# EAGLE schematic EEZ DIB AUX PS r3B6 (EAGLE 7.2.0)
Assembly variants: Farnell, TME

## Sheet 1 of 2: Power board tester
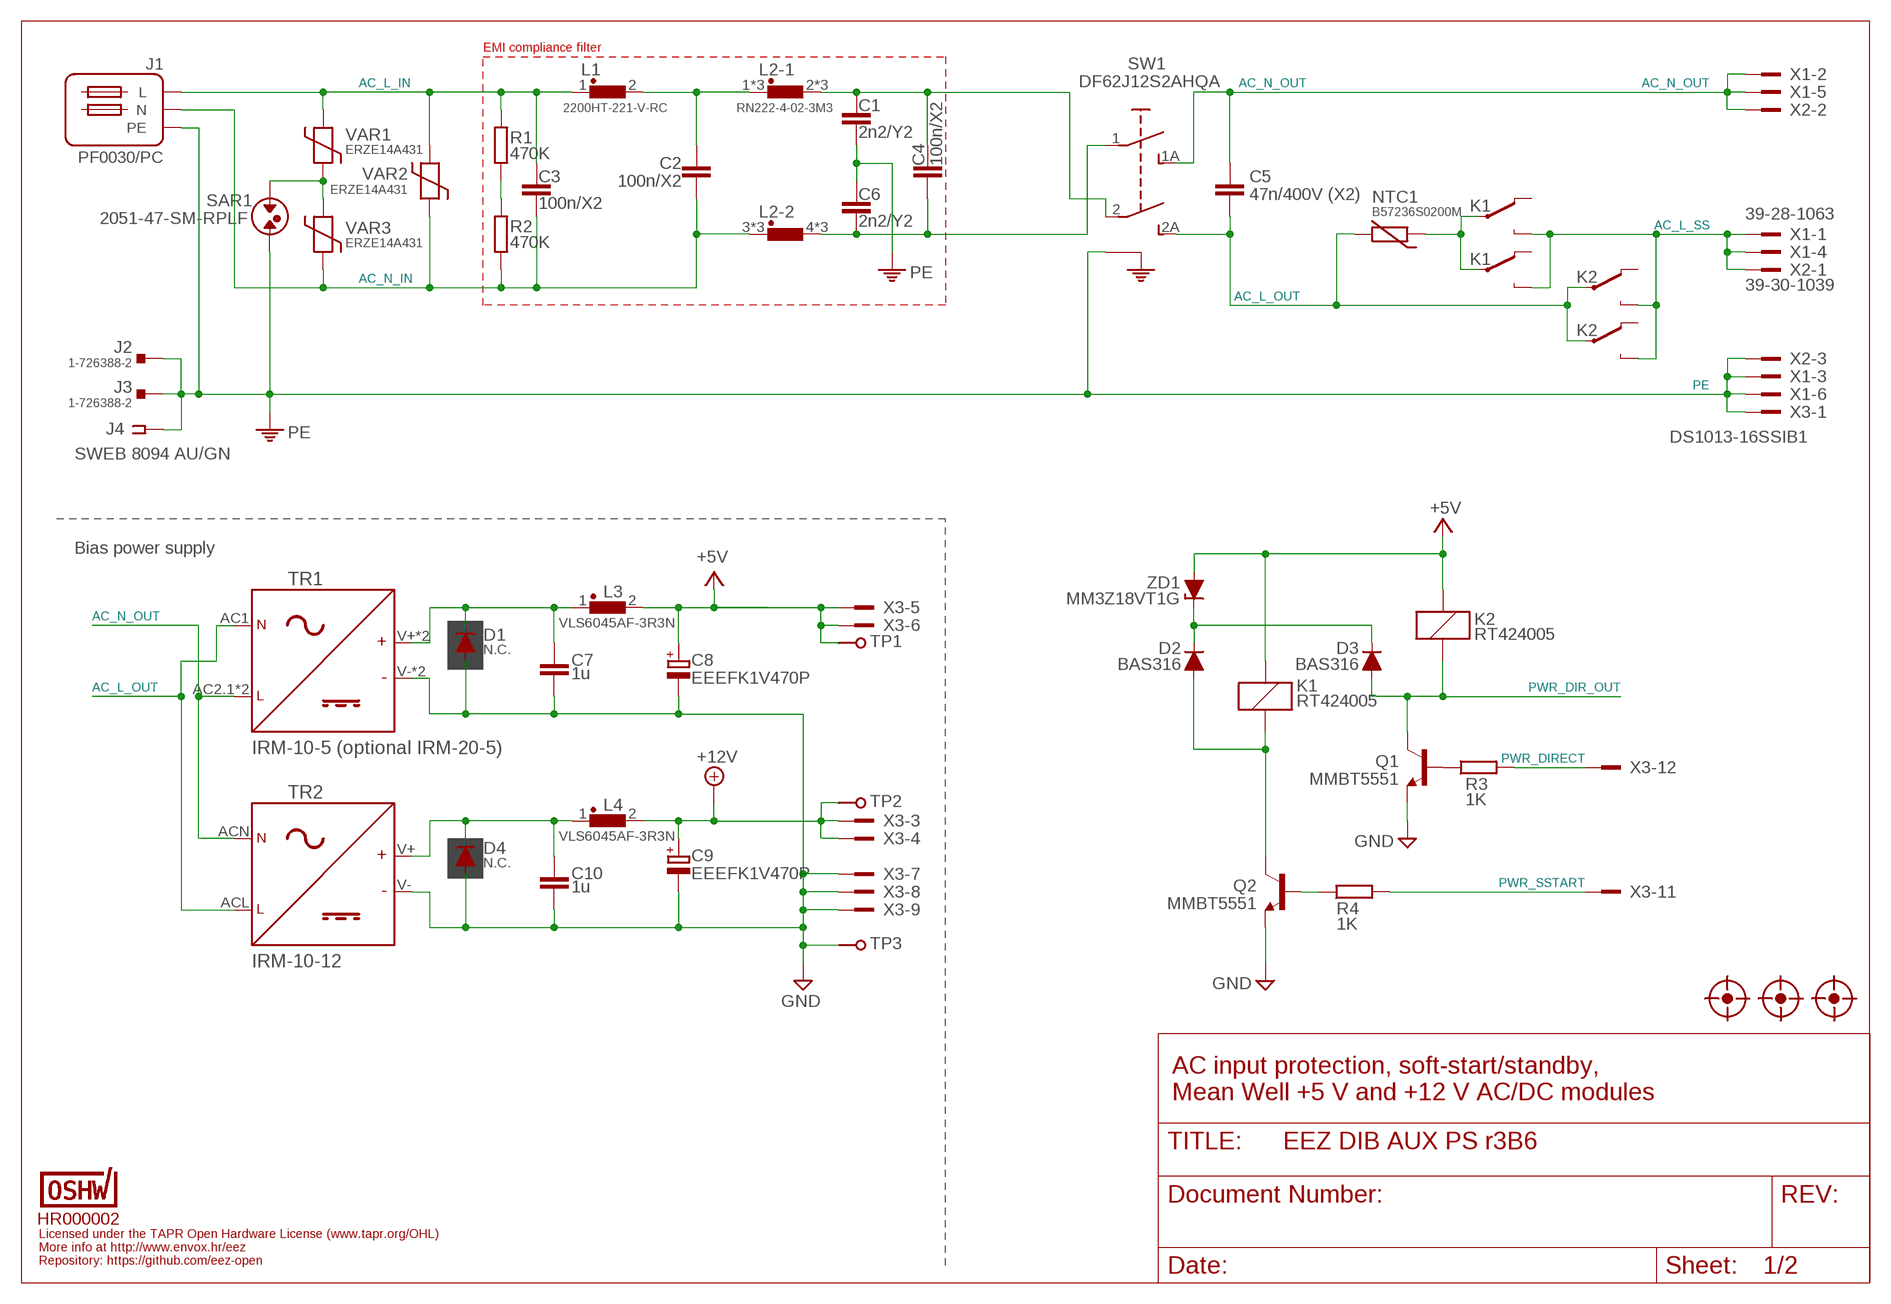
[diagram p0: schematic, sheet 1]

### Parts
C1  2n2/Y2  C-EU075-042X103  [C075-042X103]
C2  100n/X2  C-EU150-054X183  [C150-054X183]
C3  100n/X2  C-EU150-054X183  [C150-054X183]
C4  100n/X2  C-EU150-054X183  [C150-054X183]
C5  47n/400V (X2)  C-EU102-054X133  [C102-054X133]
C6  2n2/Y2  C-EU075-042X103  [C075-042X103]
C7  1u  C-EUC0805  [C0805]
C8  EEEFK1V470P  ECAPPANASONIC_H  [CAPAE660X610N]
C9  EEEFK1V470P  ECAPPANASONIC_H  [CAPAE660X610N]
C10  1u  C-EUC0805  [C0805]
D1  N.C.  DIODEDO214AA  [DO214AA]
D2  BAS316  DIODESOD323R  [SOD323-R]
D3  BAS316  DIODESOD323R  [SOD323-R]
D4  N.C.  DIODEDO214AA  [DO214AA]
FM1  FIDUCIAL  [FIDUCIAL]
FM2  FIDUCIAL  [FIDUCIAL]
FM3  FIDUCIAL  [FIDUCIAL]
J1  PF0030/PC  [PF0030/PC]
J2  1-726388-2  PCB_TAB4.8MM  [PCB_TAB-4.8MM]
J3  1-726388-2  PCB_TAB4.8MM  [PCB_TAB-4.8MM]
J4  SWEB 8094 AU/GN  BINDING_POSTCLIFF  [S16N-PC]
K1  RT424005  RELAY_RT314012-2  [RT-C/016A5_ROUND]
K2  RT424005  RELAY_RT314012-2  [RT-C/016A5_ROUND]
L1  2200HT-221-V-RC  BOURNS_2200  [BOURNS_2200]
L2  RN222-4-02-3M3  BOURNS_7100-COMBO  [BOURNS_7100_COMBO]
L3  VLS6045AF-3R3N  COILCRAFT_HPI0630  [COILCRAFT_HPI0630]
L4  VLS6045AF-3R3N  COILCRAFT_HPI0630  [COILCRAFT_HPI0630]
LABEL1  HR000002  OSHWA-CERT-SMALL  [CERT-SMALL-SILK]
NTC1  B57236S0200M  NTC11.5X6  [NTC_11.5X6_RM5]
Q1  MMBT5551  MMBT5551LT1-NPN-SOT23-BEC  [SOT23-BEC]
Q2  MMBT5551  MMBT5551LT1-NPN-SOT23-BEC  [SOT23-BEC]
R1  470K  R-EU_R1206  [R1206]
R2  470K  R-EU_R1206  [R1206]
R3  1K  R-EU_R0805  [R0805]
R4  1K  R-EU_R0805  [R0805]
SAR1  2051-47-SM-RPLF  SAR-SG  [SAR_4.5MM]
SW1  DF62J12S2AHQA  [DF62J12S2]
TP1  PCB_TEST_TABSHIELD  [PCB_SHIELD_TAB]
TP2  PCB_TEST_TABSHIELD  [PCB_SHIELD_TAB]
TP3  PCB_TEST_TABSHIELD  [PCB_SHIELD_TAB]
TR1  IRM-10-5 (optional IRM-20-5)  AC_DC_ADAPTERIRM10/20  [IRM-10/20_COMBO]
TR2  IRM-10-12  AC_DC_ADAPTERIRM10  [IRM-10]
VAR1  ERZE14A431  VARISTOR-16  [VARISTOR_16MM]
VAR2  ERZE14A431  VARISTOR-16  [VARISTOR_16MM]
VAR3  ERZE14A431  VARISTOR-16  [VARISTOR_16MM]
X1  39-28-1063  MINIFIT_5566-06A-CRE  [MINIFIT_5566-06A_CRE]
X2  39-30-1039  MINIFIT_39301039-CREEPAGE  [MINIFIT_39301039_CRE]
X3  DS1013-16SSIB1  IDC-16PIN  [IDC-16PIN]
ZD1  MM3Z18VT1G  ZENER-DIODESOD323R  [SOD323-R]

### Nets
+5V: C8.1(+) K1.A2(K:C1) K2.A1(K:C2) L3.2 TP1.1 X3.5 X3.6 ZD1.A ; also sheet 2
+12V: C9.1(+) L4.2 TP2.1 X3.3 X3.4 ; also sheet 2
AC_L_IN: C3.1 J1.L L1.1 R1.2 VAR1.2 VAR2.1
AC_L_OUT: C5.2 K2.11A(-1:P) K2.11B(-2:P) NTC1.1 SW1.2A(S1) TR1.AC1(AC/N) TR2.ACL(AC/L) ; also sheet 2
AC_L_RTC: C1.1 C4.2 L2.2 L2.2A L2.2B SW1.2(P1)
AC_L_SS: K1.14A(-1:O) K1.14B(-2:O) K2.14A(-1:O) K2.14B(-2:O) X1.1 X1.4 X2.1
AC_N_IN: C2.2 C3.2 J1.N L2.3 L2.3A L2.3B R2.1 VAR2.2 VAR3.1
AC_N_OUT: C5.1 SW1.1A(S) TR1.AC2.1(AC/L) TR1.AC2.2(AC/L) TR2.ACN(AC/N) X1.2 X1.5 X2.2 ; also sheet 2
AC_N_RTC: C4.1 C6.2 L2.4 L2.4A L2.4B SW1.1(P)
GND [gnd]: C7.2 C8.2(-) C9.2(-) C10.2 D1.A D4.A Q1.E Q2.E TP3.1 TR1.V-1(-) TR1.V-(-) TR2.V-(-) X3.7 X3.8 X3.9 ; also sheet 2
N$1: R1.1 R2.2
N$5: C2.1 L1.2 L2.1 L2.1A L2.1B
N$6: SAR1.1 VAR1.1 VAR3.2
N$7: K1.11A(-1:P) K1.11B(-2:P) NTC1.2
N$8: C10.1 D4.C L4.1 TR2.V+(+)
N$11: D2.C D3.C ZD1.C
N$12: Q2.B R4.1
N$15: C7.1 D1.C L3.1 TR1.V+1(+) TR1.V+(+)
N$16: D2.A K1.A1(K:C2) Q2.C
N$17: Q1.B R3.1
PE: C1.2 C6.1 J1.PE J2.1 J2.2 J3.1 J3.2 J4.1 J4.NC1 J4.NC2 J4.NC3 J4.NC4 SAR1.2 SW1.PE1(PE) SW1.PE2(PE) X1.3 X1.6 X2.3 X3.1
PWR_DIR_OUT: D3.A K2.A2(K:C1) Q1.C ; also sheet 2
PWR_DIRECT: R3.2 X3.12
PWR_SSTART: R4.2 X3.11
Unconnected: K1.12A(-1:S) K1.12B(-2:S) K2.12A(-1:S) K2.12B(-2:S) X3.10

### Notes on the sheet
- EMI compliance filter
- Bias power supply
- AC input protection, soft-start/standby,
  Mean Well +5 V and +12 V AC/DC modules
- Licensed under the TAPR Open Hardware License (www.tapr.org/OHL)
- More info at http://www.envox.hr/eez
- Repository: https://github.com/eez-open

## Sheet 2 of 2
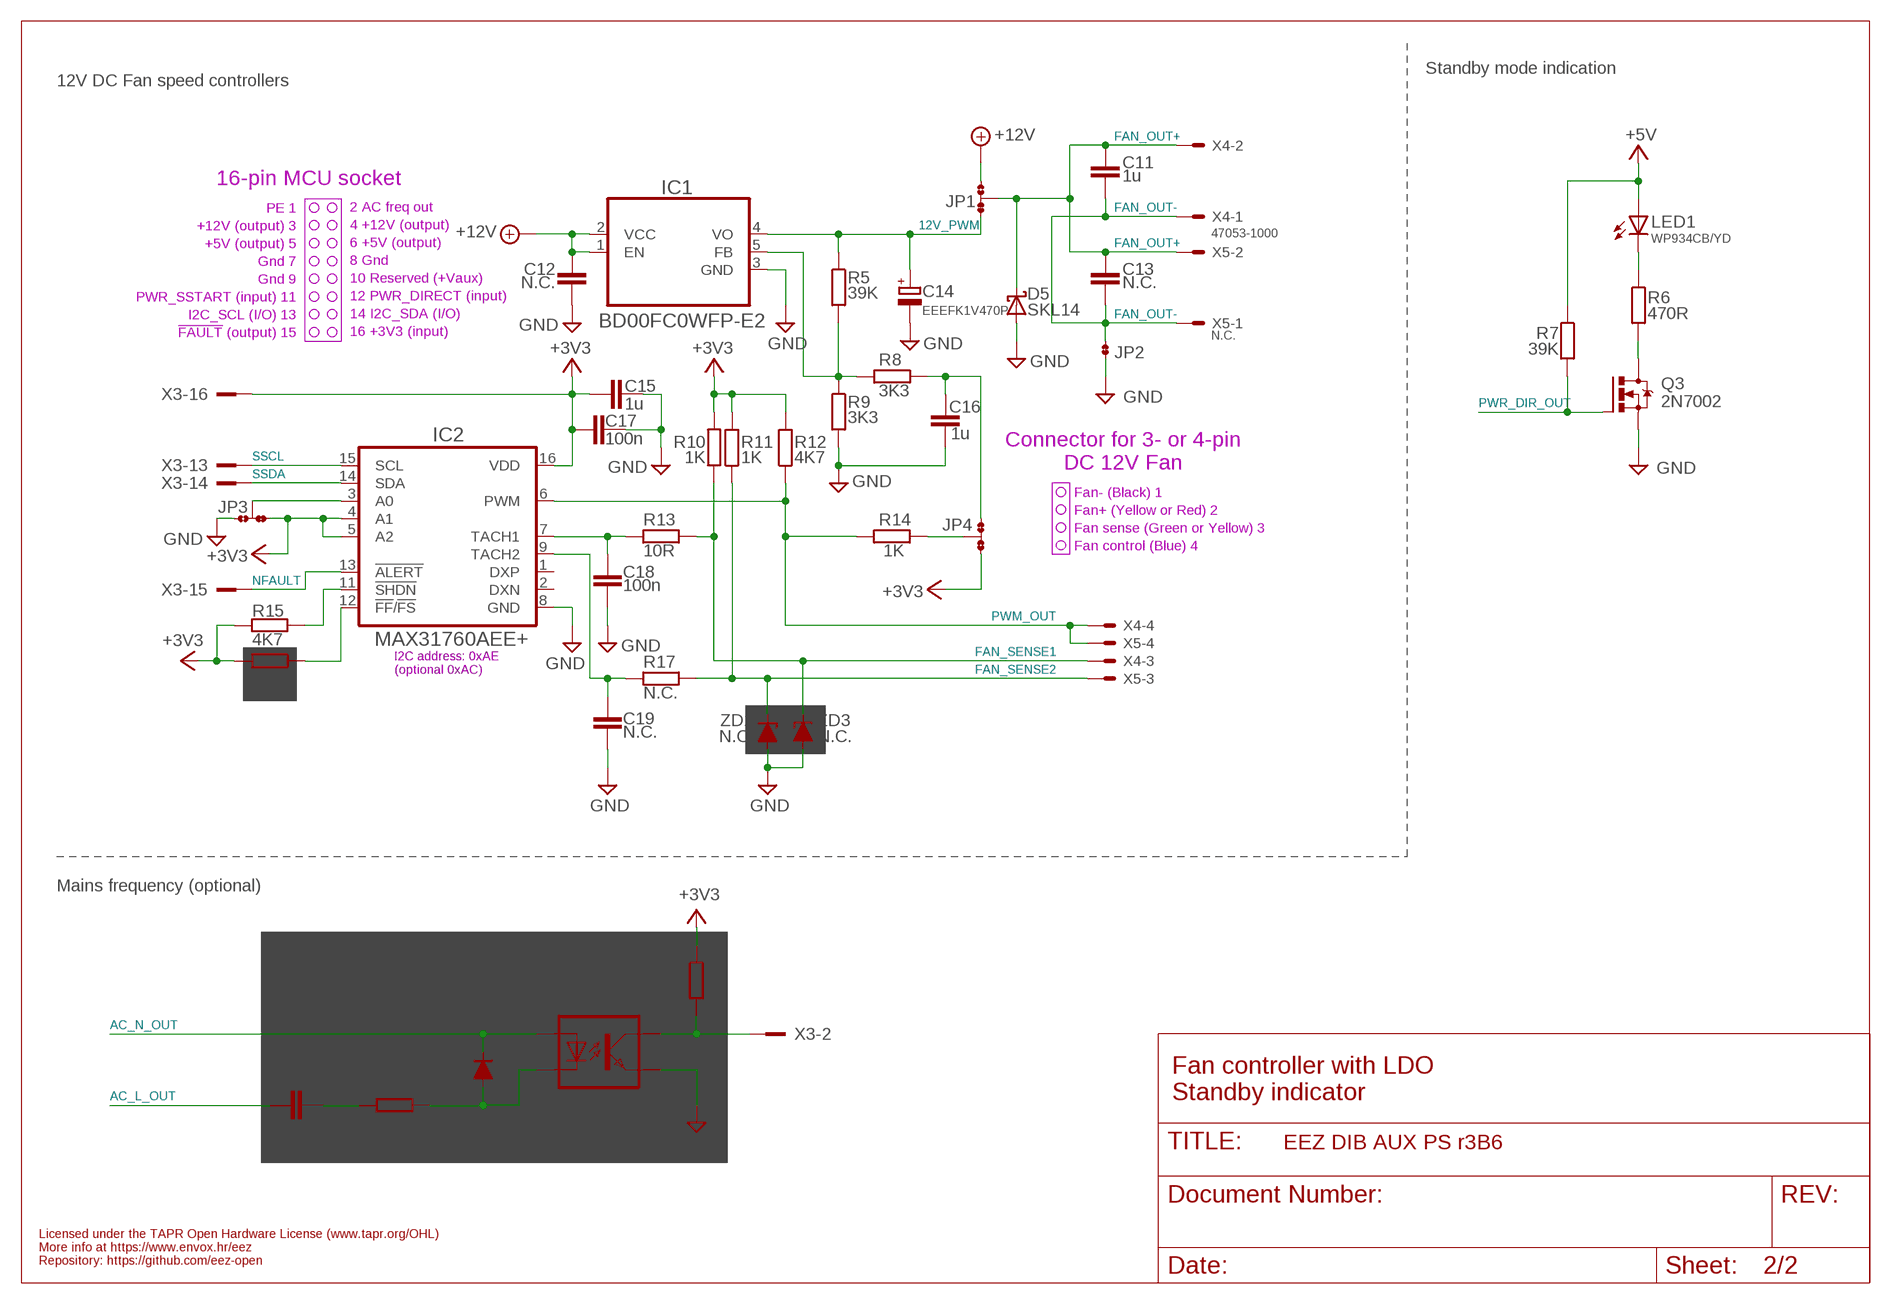
[diagram p1: schematic, sheet 2]

### Parts
C11  1u  C-EUC0805  [C0805]
C12  N.C.  C-EUC0805  [C0805]
C13  N.C.  C-EUC0805  [C0805]
C14  EEEFK1V470P  ECAPPANASONIC_H  [CAPAE660X610N]
C15  1u  C-EUC0805  [C0805]
C16  1u  C-EUC0805  [C0805]
C17  100n  C-EUC0603  [C0603]
C18  100n  C-EUC0603  [C0603]
C19  N.C.  C-EUC0603  [C0603]
C20  N.C.  C-EU102-054X133  [C102-054X133]
D5  SKL14  SCHOTTKYSOD123  [SOD123]
D6  N.C.  DIODESOD323R  [SOD323-R]
IC1  BD00FC0WFP-E2  BD00FC0W  [TO-252-5]
IC2  MAX31760AEE+  [DBQ16]
JP1  JP3-CUT-0805-ROTATED  [JP3-0805-CUT2]
JP2  JP2-NOCUT-0805  [JP2-0805-NOCUT]
JP3  JP3-CUT-0805-ROTATED  [JP3-0805-CUT2]
JP4  JP3-CUT-0805-ROTATED  [JP3-0805-CUT2]
LED1  WP934CB/YD  [WP934CB/YD]
OK1  N.C.  TLP291  [SO4]
Q3  2N7002  [SOT103P240X110-3N]
R5  39K  R-EU_R0805  [R0805]
R6  470R  R-EU_R0805  [R0805]
R7  39K  R-EU_R0805  [R0805]
R8  3K3  R-EU_R0805  [R0805]
R9  3K3  R-EU_R0805  [R0805]
R10  1K  R-EU_R0805  [R0805]
R11  1K  R-EU_R0805  [R0805]
R12  4K7  R-EU_R0805  [R0805]
R13  10R  R-EU_R0805  [R0805]
R14  1K  R-EU_R0805  [R0805]
R15  4K7  R-EU_R0805  [R0805]
R16  N.C.  R-EU_R0805  [R0805]
R17  N.C.  R-EU_R0805  [R0805]
R18  N.C.  R-EU_R0805  [R0805]
R19  N.C.  R-EU_R0805  [R0805]
X4  47053-1000  [47053-1000]
X5  N.C.  47053-1000  [47053-1000]
ZD2  N.C.  ZENER-DIODESOD123  [SOD123]
ZD3  N.C.  ZENER-DIODESOD123  [SOD123]

### Nets
12V_PWM: C14.1(+) IC1.4(VO) JP1.NC R5.1
+3V3: C15.2 C17.2 IC2.4(A1) IC2.5(A2) IC2.16(VDD) JP3.NC JP4.NO R10.2 R11.2 R12.2 R15.2 R16.2 R18.1 X3.16
+5V: LED1.A R7.1 ; also sheet 1
+12V: C12.1 IC1.1(EN) IC1.2(VCC) JP1.NO ; also sheet 1
AC_L_OUT: C20.1 ; also sheet 1
AC_N_OUT: D6.C OK1.1(A) ; also sheet 1
FAN_OUT+: C11.1 C13.1 D5.C JP1.COM X4.2 X5.2
FAN_OUT-: C11.2 C13.2 JP2.2 X4.1 X5.1
FAN_SENSE1: R10.1 R13.2 X4.3 ZD3.C
FAN_SENSE2: R11.1 R17.2 X5.3 ZD2.C
GND [gnd]: C12.2 C14.2(-) C15.1 C16.2 C17.1 C18.2 C19.2 D5.A IC1.3(GND) IC2.8(GND) JP2.1 JP3.NO OK1.3(EMIT) Q3.2(S) R9.2 ZD2.A ZD3.A ; also sheet 1
LDO_FB: IC1.5(FB) R5.2 R8.1 R9.1
N$2: C18.1 IC2.7(TACH1) R13.1
N$3: IC2.12(!FF!/!FS!) R16.1
N$4: JP4.COM R14.1
N$9: C16.1 JP4.NC R8.2
N$10: D6.A OK1.2(C) R19.2
N$13: Q3.3(D) R6.2
N$14: LED1.C R6.1
N$18: IC2.11(!SHDN) R15.1
N$19: OK1.4(COL) R18.2 X3.2
N$20: C20.2 R19.1
N$21: C19.1 IC2.9(TACH2) R17.1
N$23: IC2.3(A0) JP3.COM
NFAULT: IC2.13(!ALERT) X3.15
PWM_OUT: IC2.6(PWM) R12.1 R14.2 X4.4 X5.4
PWR_DIR_OUT: Q3.1(G) R7.2 ; also sheet 1
SSCL: IC2.15(SCL) X3.13
SSDA: IC2.14(SDA) X3.14
Unconnected: IC2.1(DXP) IC2.2(DXN)

### Notes on the sheet
- 12V DC Fan speed controllers | Standby mode indication
- 16-pin MCU socket
- PE 1
- 2 AC freq out
- +12V (output) 3
- 4 +12V (output)
- +5V (output) 5
- 6 +5V (output)
- Gnd 7
- 8 Gnd
- Gnd 9
- 10 Reserved (+Vaux)
- PWR_SSTART (input) 11
- 12 PWR_DIRECT (input)
- I2C_SCL (I/O) 13
- 14 I2C_SDA (I/O)
- !FAULT! (output) 15
- 16 +3V3 (input)
- Connector for 3- or 4-pin
  DC 12V Fan
- Fan- (Black) 1
- Fan+ (Yellow or Red) 2
- Fan sense (Green or Yellow) 3
- Fan control (Blue) 4
- I2C address: 0xAE
  (optional 0xAC)
- Mains frequency (optional)
- Fan controller with LDO
  Standby indicator
- Licensed under the TAPR Open Hardware License (www.tapr.org/OHL)
- More info at https://www.envox.hr/eez
- Repository: https://github.com/eez-open

## Library data of the parts
C1-C7 C10-C13 C15-C20 = rcl:C-EU: CAPACITOR, European symbol
C8 C9 C14 = EEZ_Lib1:ECAP
D1 D4 = MyLib6:DIODE
D2 D3 D6 = EEZ_Lib1:DIODE
D5 = EEZ_Lib1:SCHOTTKY
FM1-FM3 = EEZ_Lib1:FIDUCIAL: Fiducial mark for pick and place automation
IC1 = EEZ_DIB:BD00FC0W: Single-Output low saturation 1A LDO Regulator
IC2 = EEZ_DIB:MAX31760AEE+: Precision Fan-Speed Controller with Nonvolatile Lookup Table
J1 = EEZ_connectors:PF0030/PC: PC Flanged Mount Fused Inlet, twin fused 5 x 20 mm, 250 Vac, 10 A, PC spills
J2 J3 = EEZ_connectors:PCB_TAB: PCB quick-fit terminal
J4 = EEZ_Lib1:BINDING_POST: Various 4 mm binding posts
JP1 JP3 JP4 = EEZ_Lib1:JP3-CUT
JP2 = EEZ_Lib1:JP2-NOCUT
K1 K2 = EEZ_Lib1:RELAY_RT314012
L1 = EEZ_inductors_and_transformers:BOURNS_2200
L2 = EEZ_inductors_and_transformers:BOURNS_7100: Common Mode EMI Choke
L3 L4 = EEZ_inductors_and_transformers:COILCRAFT_HPI0630: High power inductor
LABEL1 = EEZ_Lib1:OSHWA-CERT
LED1 = EEZ_Lib1:WP934CB/YD: T-1 (3mm) Single-Level Circuit Board Indicator
NTC1 = EEZ_Lib1:NTC
OK1 = EEZ_Lib1:TLP291: Toshiba Photocopler GaAs IRED & Photo-transistor
Q1 Q2 = transistor:*-NPN-: NPN Transistror BF959 corrected 2008.03.06
Q3 = EEZ_Lib1:2N7002: N-CHANNEL ENHANCEMENT MODE FIELD EFFECT TRANSISTOR; MPN: 2N7002-7-F; OC_FARNELL: 1713823; OC_NEWARK: 25R5679; PACKAGE: SOT-23-3; SUPPLIER: DIODES INC.
R1-R19 = rcl:R-EU_: RESISTOR, European symbol
SAR1 = EEZ_Lib1:SAR: EPCOS surge arrester EF470X Farnell: 1886596
SW1 = EEZ_switches:DF62J12S2: Rocker switch SPST; Positions:2; OFF-ON; 16A/250VAC; 6A/48VDC
TP1-TP3 = EEZ_Lib1:PCB_TEST_TAB
TR1 TR2 = EEZ_Lib1:AC_DC_ADAPTER: MYRRA 47202 AC/DC PCB Mount Power Supply, Switch Mode, Fixed, 1 Output
VAR1-VAR3 = EEZ_Lib1:VARISTOR: EPCOS - B72220S0251K101 - VARISTOR, 140J, 250VAC Farnell: 1004357
X1 = EEZ_connectors:MINIFIT_5566-06A: Molex Socket; wire-board; male; Mini-Fit Jr; 4.2mm; PIN:6; THT; 9A; tinned
X2 = EEZ_connectors:MINIFIT_39301039: MOLEX socket; wire-board; male; Mini-Fit Jr; 4.2mm; PIN:3; THT; PCB snap
X3 = EEZ_connectors:IDC-16PIN: 16-pin IDC socket
X4 X5 = EEZ_connectors:47053-1000: KK 254 Vertical Header, with Friction Lock, 4 Circuits, PC Tail Length: 3.50mm
ZD1-ZD3 = EEZ_Lib1:ZENER-DIODE

## Net classes
0 default: width 0.152 mm, drill 0.3 mm, clearance 0.152 mm
1 diff: width 0.254 mm, drill 0.3 mm, clearance 0.254 mm
2 gnd: width 0.152 mm, drill 0.3 mm, clearance 0.152 mm